# EAGLE design freeduino_hs (EAGLE 9.2.2)
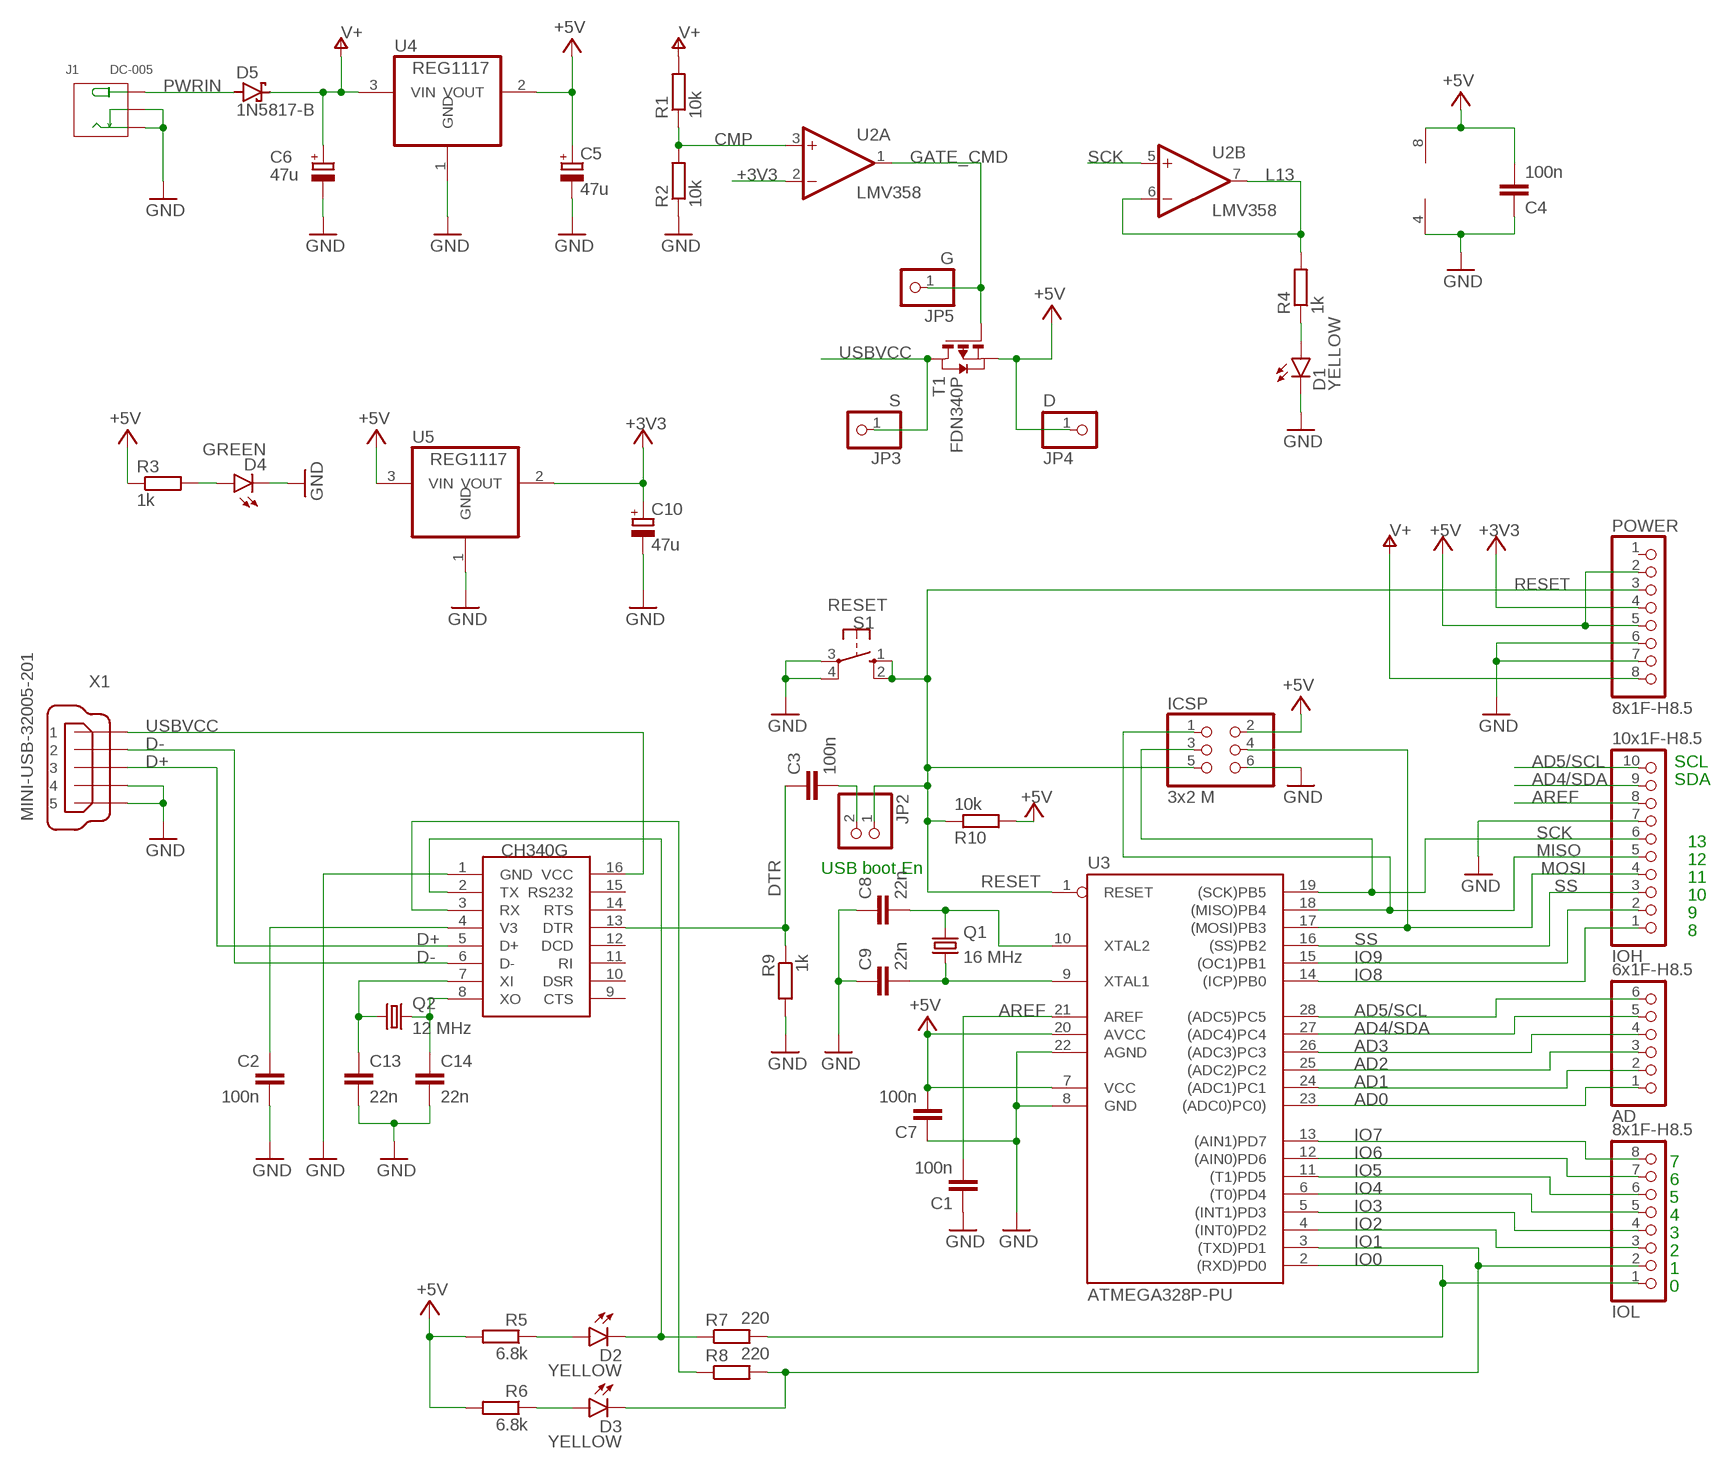
[diagram p0: schematic, sheet 1]

## Parts
AD  6x1F-H8.5  PINHD-1X6  [1X06]
C1  100n  C-EU050-024X044  [C050-024X044]
C2  100n  C-EU050-024X044  [C050-024X044]
C3  100n  C-EU050-024X044  [C050-024X044]
C4  100n  C-EU050-024X044  [C050-024X044]
C5  47u  CPOL-EUE2.5-5  [E2,5-5]
C6  47u  CPOL-EUE2.5-5  [E2,5-5]
C7  100n  C-EU050-024X044  [C050-024X044]
C8  22n  C-EU050-024X044  [C050-024X044]
C9  22n  C-EU050-024X044  [C050-024X044]
C10  47u  CPOL-EUE2.5-5  [E2,5-5]
C13  22n  C-EU050-024X044  [C050-024X044]
C14  22n  C-EU050-024X044  [C050-024X044]
D1  YELLOW  LED3MM  [LED3MM]
D2  YELLOW  LED3MM  [LED3MM]
D3  YELLOW  LED3MM  [LED3MM]
D4  GREEN  LED3MM  [LED3MM]
D5  1N5817-B  [DO41-7.6]
ICSP  3x2 M  PINHD-2X3  [2X03]
IOH  10x1F-H8.5  PINHD-1X10  [1X10]
IOL  8x1F-H8.5  PINHD-1X8  [1X08]
J1  DC-005  CONN-POWER-JACK-2.1MM(DC-005)  [DCJ3P-14.2X11.0X9.0MM]
JP2  PINHD-1X2  [1X02]
JP3  S  PINHD-1X1  [1X01]
JP4  D  PINHD-1X1  [1X01]
JP5  G  PINHD-1X1  [1X01]
POWER  8x1F-H8.5  PINHD-1X8  [1X08]
Q1  16 MHz  CRYSTALHC49S  [HC49/S]
Q2  12 MHz  CRYSTALHC49S  [HC49/S]
R1  10k  R-EU_0204/7  [0204/7]
R2  10k  R-EU_0204/7  [0204/7]
R3  1k  R-EU_0204/7  [0204/7]
R4  1k  R-EU_0204/7  [0204/7]
R5  6.8k  R-EU_0204/7  [0204/7]
R6  6.8k  R-EU_0204/7  [0204/7]
R7  220  R-EU_0204/7  [0204/7]
R8  220  R-EU_0204/7  [0204/7]
R9  1k  R-EU_0204/7  [0204/7]
R10  10k  R-EU_0204/7  [0204/7]
S1  RESET  10-XX  [B3F-10XX]
T1  FDN340P  PMOSSOT23  [SOT-23]
U1  CH340G  [SOIC16]
U2  LMV358  LMV358M  [SO08]
U3  ATMEGA328P-PU  [DIL28-3]
U4  REG1117  [SOT223]
U5  REG1117  [SOT223]
X1  MINI-USB-32005-201  [32005-201]

## Nets
+3V3: C10.+ POWER.4 U2.2(A:-IN) U5.2(VOUT)
+5V [power]: C4.2 C5.+ C7.2 ICSP.2 JP4.1 POWER.2 POWER.5 R3.1 R5.2 R6.2 R10.2 T1.2(S) U2.8(P:V+) U3.7(VCC) U3.20(AVCC) U4.2(VOUT) U5.3(VIN)
AD0: AD.1 U3.23((ADC0)PC0))
AD1: AD.2 U3.24((ADC1)PC1)
AD2: AD.3 U3.25((ADC2)PC2)
AD3: AD.4 U3.26((ADC3)PC3)
AD4/SDA: AD.5 IOH.9 U3.27((ADC4)PC4)
AD5/SCL: AD.6 IOH.10 U3.28((ADC5)PC5)
AREF [aref]: C1.2 IOH.8 U3.21(AREF)
CMP: R1.1 R2.2 U2.3(A:+IN)
D+: U1.5(D+) X1.3
D-: U1.6(D-) X1.2
DTR: C3.1 R9.1 U1.13(DTR)
GATE_CMD: JP5.1 T1.3(G) U2.1(A:OUT)
GND [gnd]: C1.1 C2.2 C4.1 C5.- C6.- C7.1 C8.1 C9.1 C10.- C13.2 C14.2 D1.K(C) D4.K(C) ICSP.6 IOH.7 J1.-1(-) J1.-2(CDN) POWER.6 POWER.7 R2.1 R9.2 S1.3(P) S1.4(P1) U1.1(GND) U2.4(P:V-) U3.8(GND) U3.22(AGND) U4.1(GND) U5.1(GND) X1.4 X1.5
IO0: IOL.1 R7.2 U3.2((RXD)PD0)
IO1: D3.K(C) IOL.2 R8.2 U3.3((TXD)PD1)
IO2: IOL.3 U3.4((INT0)PD2)
IO3: IOL.4 U3.5((INT1)PD3)
IO4: IOL.5 U3.6((T0)PD4)
IO5: IOL.6 U3.11((T1)PD5)
IO6: IOL.7 U3.12((AIN0)PD6)
IO7: IOL.8 U3.13((AIN1)PD7)
IO8: IOH.1 U3.14((ICP)PB0)
IO9: IOH.2 U3.15((OC1)PB1)
L13: R4.2 U2.6(B:-IN) U2.7(B:OUT)
M8RXD: R8.1 U1.3(RX)
MISO: ICSP.1 IOH.5 U3.18((MISO)PB4)
MOSI: ICSP.4 IOH.4 U3.17((MOSI)PB3)
N$1: D1.A R4.1
N$2: C2.1 U1.4(V3)
N$3: D4.A R3.2
N$4: C3.2 JP2.2
N$35: D3.A R6.1
N$36: D2.A R5.1
N$93: D2.K(C) R7.1 U1.2(TX)
PWRIN [power]: D5.A J1.+
RESET: ICSP.5 JP2.1 POWER.3 R10.1 S1.1(S) S1.2(S1) U3.1(RESET)
SCK: ICSP.3 IOH.6 U2.5(B:+IN) U3.19((SCK)PB5)
SS: IOH.3 U3.16((SS)PB2)
USBVCC [usbvcc]: JP3.1 T1.1(D) U1.16(VCC) X1.1
V+: C6.+ D5.C POWER.8 R1.2 U4.3(VIN)
XI: C13.1 Q2.2 U1.7(XI)
XO: C14.1 Q2.1 U1.8(XO)
XTAL1: C9.2 Q1.1 U3.9(XTAL1)
XTAL2: C8.2 Q1.2 U3.10(XTAL2)
Unconnected: POWER.1 U1.9(CTS) U1.10(DSR) U1.11(RI) U1.12(DCD) U1.14(RTS) U1.15(RS232)

## Notes on the sheet
- SCL
- SDA
- 13
- 12
- USB boot En
- 11
- 10
- 9
- 8
- 7
- 6
- 5
- 4
- 3
- 2
- 1
- 0

## Library data of the parts
AD = SmartPrj:PINHD-1X6: PIN HEADER
C1-C4 C7-C9 C13 C14 = rcl_edited:C-EU: CAPACITOR, European symbol; SPICEPREFIX: C
C5 C6 C10 = rcl:CPOL-EU: POLARIZED CAPACITOR, European symbol; SPICEPREFIX: C
D1-D4 = led:LED: LED OSRAM: - CHIPLED LG R971, LG N971, LY N971, LG Q971, LY Q971, LO R971, LY R971 LH N974, LH R974 LS Q976, LO Q976, LY Q976 LO Q996 - Hyper CHIPLED LW Q18S LB Q993, LB Q99A, LB R99A - SideLED LS A670, LO A670, LY A670, LG A670, LP A670 LB A673, LV A673, LT A673, LW A673 LH A674 LY A675 LS A676, LA A676, LO A676, LY A676, LW A676 LS A679, LY A679, LG A679 - Hyper Micro SIDELED® LS Y876, LA Y876, LO Y876, LY Y876 LT Y87S - SmartLED LW L88C, LW L88S LB L89C, LB L89S, LG L890 LS L89K, LO L89K, LY L89K LS L896, LA L896, LO L896, LY L896 - TOPLED LS T670, LO T670, LY T670, LG T670, LP T670 LSG T670, LSP T670, LSY T670, LOP T670, LYG T670 LG T671, LOG T671, LSG T671 LB T673, LV T673, LT T673, LW T673 LH T674 LS T676, LA T676, LO T676, LY T676, LB T676, LH T676, LSB T676, LW T676 LB T67C, LV T67C, LT T67C, LS T67K, LO T67K, LY T67K, LW E67C LS E67B, LA E67B, LO E67B, LY E67B, LB E67C, LV E67C, LT E67C LW T67C LS T679, LY T679, LG T679 LS T770, LO T770, LY T770, LG T770, LP T770 LB T773, LV T773, LT T773, LW T773 LH T774 LS E675, LA E675, LY E675, LS T675 LS T776, LA T776, LO T776, LY T776, LB T776 LHGB T686 LT T68C, LB T68C - Hyper Mini TOPLED® LB M676 - Mini TOPLED Santana® LG M470 LS M47K, LO M47K, LY M47K Source: http://www.osram.convergy.de LUXEON: - LUMILED® LXK2-PW12-R00, LXK2-PW12-S00, LXK2-PW14-U00, LXK2-PW14-V00 LXK2-PM12-R00, LXK2-PM12-S00, LXK2-PM14-U00 LXK2-PE12-Q00, LXK2-PE12-R00, LXK2-PE12-S00, LXK2-PE14-T00, LXK2-PE14-U00 LXK2-PB12-K00, LXK2-PB12-L00, LXK2-PB12-M00, LXK2-PB14-N00, LXK2-PB14-P00, LXK2-PB14-Q00 LXK2-PR12-L00, LXK2-PR12-M00, LXK2-PR14-Q00, LXK2-PR14-R00 LXK2-PD12-Q00, LXK2-PD12-R00, LXK2-PD12-S00 LXK2-PH12-R00, LXK2-PH12-S00 LXK2-PL12-P00, LXK2-PL12-Q00, LXK2-PL12-R00 Source: www.luxeon.com KINGBRIGHT: KA-3528ASYC Source: www.kingbright.com
D5 = diode:1N581*: 1.0A SCHOTTKY BARRIER RECTIFIER Source: http://www.diodes.com/datasheets/ds23001.pdf
ICSP = SmartPrj:PINHD-2X3: PIN HEADER
IOH = pinhead:PINHD-1X10: PIN HEADER
IOL POWER = SmartPrj:PINHD-1X8: PIN HEADER
J1 = OPL_Connector:CONN-POWER-JACK-2.1MM(DC-005): 320120003; MPN: DC-005
JP2 = pinhead:PINHD-1X2: PIN HEADER
JP3-JP5 = pinhead:PINHD-1X1: PIN HEADER
Q1 Q2 = crystal:CRYSTAL: CRYSTAL; OC_FARNELL: 1667008; OC_NEWARK: unknown
R1-R10 = resistor:R-EU_: RESISTOR, European symbol
S1 = switch-omron:10-XX: OMRON SWITCH; MPN: B3F-1000; OC_FARNELL: 176432; OC_NEWARK: 36M3542
T1 = zetex:PMOSSOT23: MOS FET; OC_FARNELL: unknown; OC_NEWARK: unknown
U1 = ch340g:CH340G
U2 = linear:LMV358?*: Dual General Purpose, Low Voltage, Rail-to-Rail Output Operational Amplifiers Source: http://www.national.com/mpf/LM/LMV321.html http://www.national.com/dt/lmv_qual.pdf
U3 = SmartPrj:ATMEGA328P-: MICROCONTROLLER 4 Kbytes FLASH 128 bytes SRAM 256 bytes EEPROM UART 6-channel 10 bit ADC
U4 U5 = burr-brown:REG1117: 800mA and 1A Low Dropout (LDO) Positive Regulator 1.8V, 2.5V, 2.85V, 3.3V, 5V, and Adj; MPN: REG1117; OC_FARNELL: 1097566; OC_NEWARK: 14P6981
X1 = con-cypressindustries:MINI-USB-: MINI USB-B Conector Source: www.cypressindustries.com; OC_FARNELL: unknown; OC_NEWARK: unknown

## Net classes
0 default: width 0.406 mm, drill 0.305 mm, clearance 0.152 mm
1 power: width 0.508 mm, drill 0.305 mm, clearance 0.152 mm
2 gnd: width 1.016 mm, drill 0.305 mm, clearance 0.152 mm
3 usbvcc: width 1.016 mm, drill 0.305 mm, clearance 0.152 mm
4 aref: width 0.406 mm, drill 0.305 mm, clearance 0.152 mm

## Board
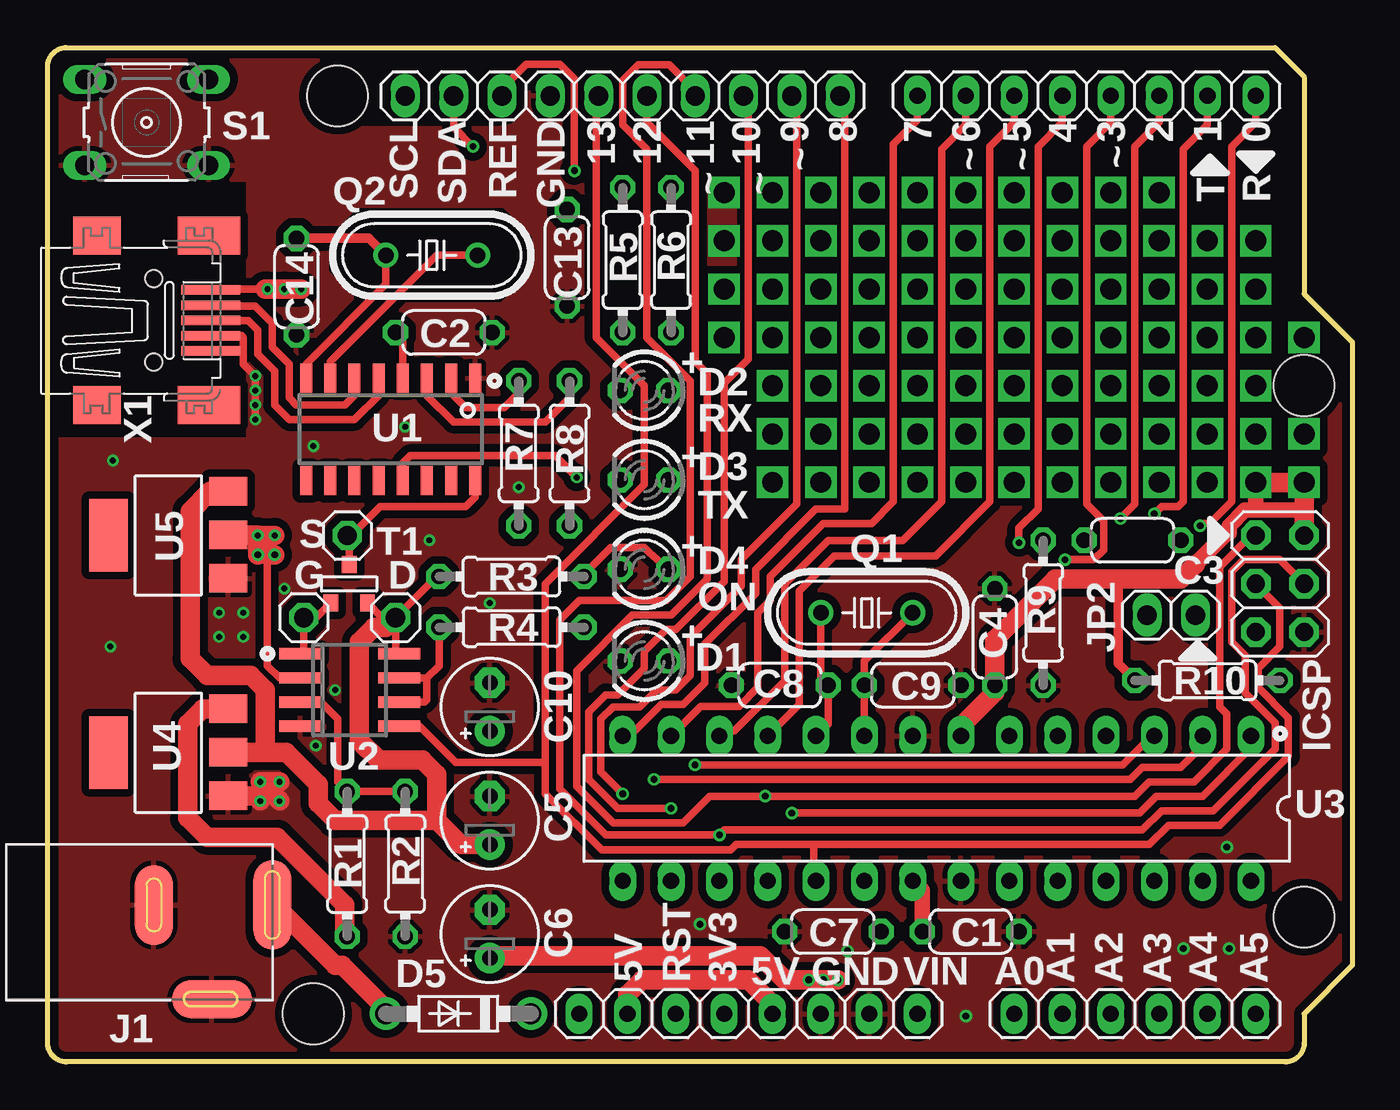
[diagram p1: board, top side]
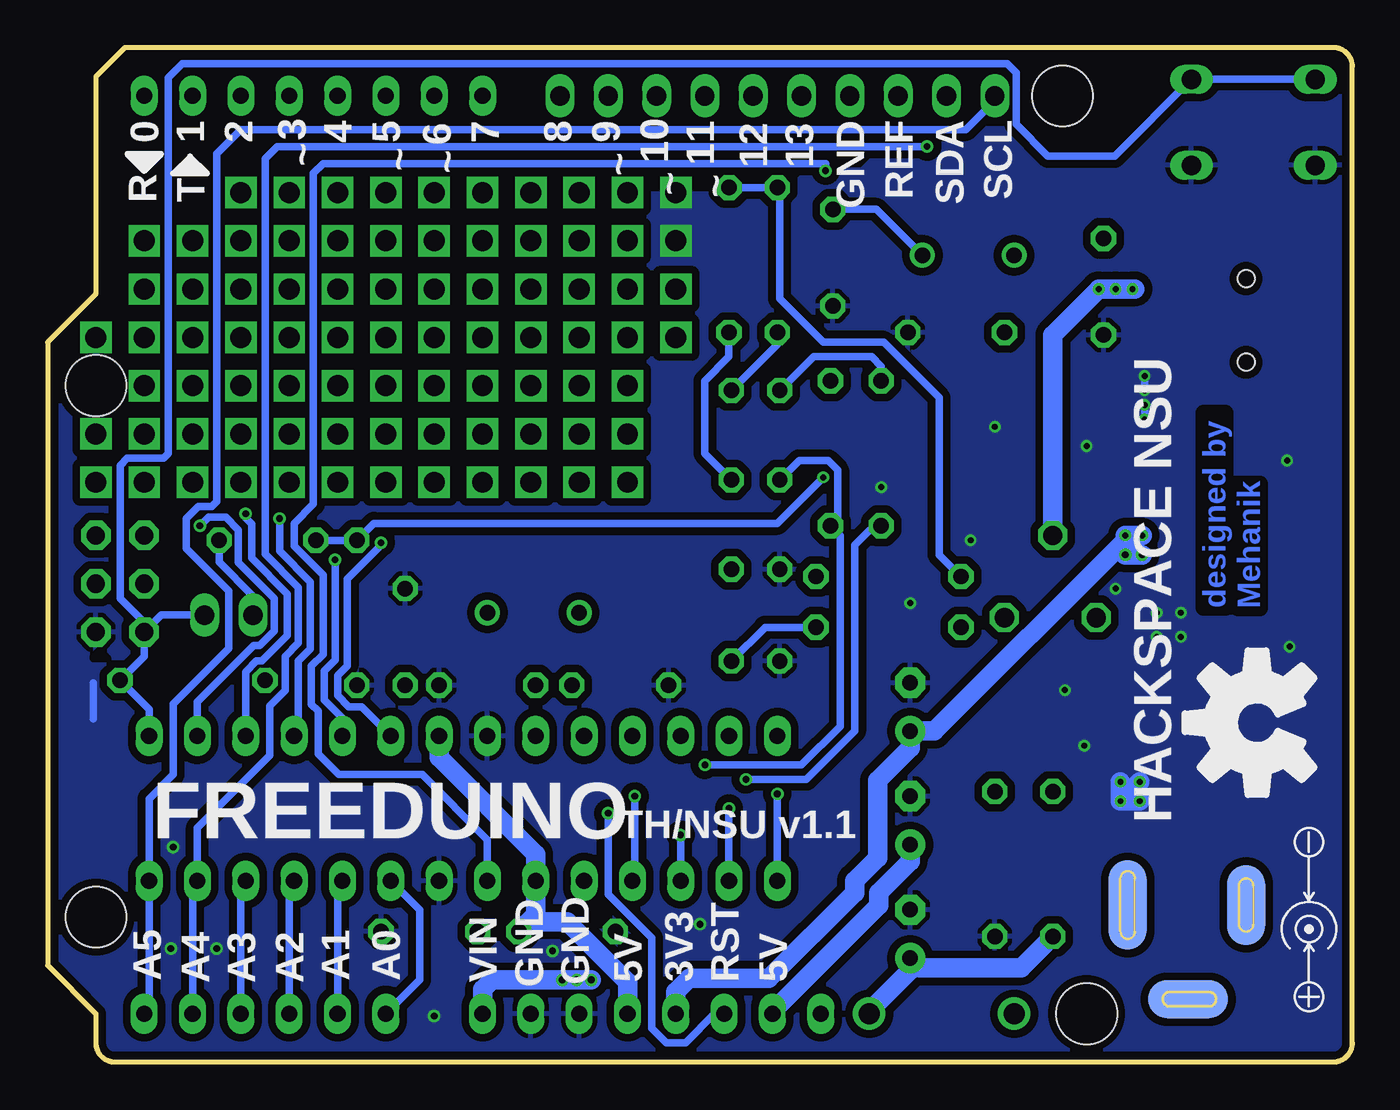
[diagram p2: board, bottom side, seen from below]

Size 68.58 x 53.34 mm. Coordinates in mm from the lower left corner, seen from the top.
Outline: 64.52,53.34 66.04,51.82 66.04,40.39 68.58,37.85 68.58,5.08 66.04,2.54 66.04,1 arc-90 65.04,0 1,0 arc-90 0,1 0,52.34 arc-90 1,53.34 64.52,53.34
Copper layers (1*16): Top 0.035mm / dielectric 1.5mm / Bottom 0.035mm
Design rules "SeeedStudio_2layer_DRU_no_angle_20140221 *": minimum track width 6mil, minimum drill 0.3mm, track to track 6mil, track to pad 6mil, pad to pad 6mil, via to via 6mil, smd to smd 0mil, copper to edge 10mil, drill to drill 10mil, minimum pad ring 10mil, minimum via ring 6mil, stop-mask expansion 2mil, vias tented up to drill 100mil, thermal gap 10mil
Holes 3.2 mm at 66.04,35.56 66.04,7.62 15.24,50.8 13.97,2.54
vRestrict: area 22.9,44.1 to 24.6,49.1; area 25.4,45.5 to 27.1,49.1; area 28.4,45.3 to 29.6,48.8; area 31,45.3 to 32.1,48.8; area 33.5,45.3 to 34.7,48.8; area 36.1,45.3 to 37.2,48.8; area 38.7,47.2 to 39.9,48.8; area 40.3,45.1 to 47.6,46.9; area 60.3,44.2 to 61.7,46.7; area 62.9,44.2 to 64.3,46.7; area 61.3,35.8 to 64.8,37.2; area 0.6,21.8 to 2,30.1; 14 more areas

### Footprints (pad centres in the part's own frame; a part is rotated, then mirrored left to right if it is on the bottom)
1X06 = drill 0.85 pad 1.422 long: 1 -6.35,0; 2 -3.81,0; 3 -1.27,0; 4 1.27,0; 5 3.81,0; 6 6.35,0
C050-024X044 = drill 0.813 octagon: 1 -2.54,0; 2 2.54,0
E2,5-5 = drill 0.813 pad 1.6: + -1.27,0 | drill 0.813 pad 1.6 octagon: - 1.27,0
LED3MM = drill 0.813 octagon: A -1.27,0; K 1.27,0
DO41-7.6 = drill 1.1 pad 1.7: A 3.81,0; C -3.81,0
2X03 = drill 0.95 pad 1.55 octagon: 1 -2.54,-1.27; 2 -2.54,1.27; 3 0,-1.27; 4 0,1.27; 5 2.54,-1.27; 6 2.54,1.27
1X10 = drill 1.016 long: 1 -11.43,0; 2 -8.89,0; 3 -6.35,0; 4 -3.81,0; 5 -1.27,0; 6 1.27,0; 7 3.81,0; 8 6.35,0; 9 8.89,0; 10 11.43,0
1X08 = drill 0.85 pad 1.422 long: 1 -8.89,0; 2 -6.35,0; 3 -3.81,0; 4 -1.27,0; 5 1.27,0; 6 3.81,0; 7 6.35,0; 8 8.89,0
DCJ3P-14.2X11.0X9.0MM = smd 2 x 4.7: + 3.175,0 | smd 2 x 4.7 bottom: +1 3.175,0 | smd 2 x 4.2: -1 -3.048,0 | smd 4.2 x 2: -2 0,-4.953 | smd 2 x 4.2 bottom: -3 -3.048,0 | smd 4.2 x 2 bottom: -4 0,-4.953
1X02 = drill 1.016 long: 1 -1.27,0; 2 1.27,0
1X01 = drill 1.016 octagon: 1 0,0
HC49/S = drill 0.813: 1 -2.413,0; 2 2.413,0
0204/7 = drill 0.813 octagon: 1 -3.81,0; 2 3.81,0
B3F-10XX = drill 1.016 long: 1 -3.251,2.261; 2 3.251,2.261; 3 -3.251,-2.261; 4 3.251,-2.261
SOT-23 = smd 0.787 x 0.889: 1 0.025,-1.016; 2 -0.94,1.016; 3 0.991,1.016
SOIC16 = smd 0.635 x 1.524: 1 -4.445,-2.695; 2 -3.175,-2.695; 3 -1.905,-2.695; 4 -0.635,-2.695; 5 0.635,-2.695; 6 1.905,-2.695; 7 3.175,-2.695; 8 4.445,-2.695; 9 4.445,2.695; 10 3.175,2.695; 11 1.905,2.695; 12 0.635,2.695; 13 -0.635,2.695; 14 -1.905,2.695; 15 -3.175,2.695; 16 -4.445,2.695
SO08 = smd 0.6 x 2.2: 1 -1.905,-2.6; 2 -0.635,-2.6; 3 0.635,-2.6; 4 1.905,-2.6; 5 1.905,2.6; 6 0.635,2.6; 7 -0.635,2.6; 8 -1.905,2.6
DIL28-3 = drill 0.85 pad 1.422 long: 1 -16.51,-3.81; 2 -13.97,-3.81; 3 -11.43,-3.81; 4 -8.89,-3.81; 5 -6.35,-3.81; 6 -3.81,-3.81; 7 -1.27,-3.81; 8 1.27,-3.81; 9 3.81,-3.81; 10 6.35,-3.81; 11 8.89,-3.81; 12 11.43,-3.81; 13 13.97,-3.81; 14 16.51,-3.81; 15 16.51,3.81; 16 13.97,3.81; 17 11.43,3.81; 18 8.89,3.81; 19 6.35,3.81; 20 3.81,3.81; 21 1.27,3.81; 22 -1.27,3.81; 23 -3.81,3.81; 24 -6.35,3.81; 25 -8.89,3.81; 26 -11.43,3.81; 27 -13.97,3.81; 28 -16.51,3.81
SOT223 = smd 1.499 x 2.007: 1 -2.261,-3.15; 2 0.025,-3.15; 3 2.311,-3.15 | smd 3.81 x 2.007: 4 0,3.15
32005-201 = smd 3.1 x 0.5: 1 3,1.6; 2 3,0.8; 3 3,0; 4 3,-0.8; 5 3,-1.6 | smd 2.5 x 2: M1 -3,-4.45; M2 -3,4.45 | smd 3.3 x 2: M3 2.9,4.45; M4 2.9,-4.45 | hole 0.9: 0,2.2; 0,-2.2

### Placement (x,y rotation side)
AD  57.15,2.54 0 top
C1  48.51,6.86 180 top
C2  20.83,38.35 0 top
C3  57.02,27.43 0 top
C4  49.78,22.35 270 top
C5  23.24,12.7 90 top
C6  23.24,6.73 90 top
C7  41.27,6.86 0 top
C8  38.48,19.81 0 top
C9  45.47,19.81 180 top
C10  23.24,18.67 90 top
C13  27.3,42.29 270 top
C14  13.08,40.77 270 top
D1  31.37,21.08 180 top
D2  31.37,35.31 180 top
D3  31.37,30.61 180 top
D4  31.37,25.91 180 top
D5  21.59,2.54 180 top
ICSP  64.77,25.15 270 top
IOH  30.23,50.8 180 top
IOL  54.61,50.8 180 top
J1  8.64,8.26 0 top
JP2  59.05,23.5 180 top
JP3  15.75,27.69 0 top
JP4  18.29,23.37 0 top
JP5  13.46,23.37 0 top
POWER  36.83,2.54 0 top
Q1  43.05,23.62 180 top
Q2  20.19,42.42 0 top
R1  15.75,10.41 270 top
R2  18.8,10.41 90 top
R3  24.38,25.53 0 top
R4  24.38,22.86 180 top
R5  30.23,42.16 90 top
R6  32.77,42.16 90 top
R7  24.77,32 270 top
R8  27.43,32 270 top
R9  52.32,23.62 270 top
R10  60.96,20.07 180 top
S1  5.21,49.4 0 top
T1  15.88,25.15 180 top
U1  18.03,33.27 180 top
U2  15.88,19.56 270 top
U3  46.74,13.34 180 top
U4  6.35,16.26 90 top
U5  6.35,27.69 90 top
X1  5.59,38.99 0 top

### Tracks (layer width: path | path; a pad name or v marks a point on that pad's centre or on a via)
+3V3  (via drill 0.3, 0.35)
  Top 0.406: U2.2 12.19,20.19 11.56,20.83 11.56,26.67 11.56,27.3 v11.94,27.69
  Top 1.016: U5.2 11.02,27.71 v11.05,27.69 | v11.05,27.69 v11.94,27.69 | v11.05,27.69 v11.05,26.67 | v11.94,26.67 11.56,26.67
  Bottom 1.016: v11.05,27.69 v11.94,27.69 11.94,27.43 21.97,17.4 C10.+ 23.24,16.51 24.96,14.8 24.96,10.73 26.16,9.53 26.16,8.91 30.67,4.39 34.85,4.39 35.56,3.68 POWER.4 | v11.05,26.67 v11.94,26.67
+5V  (via drill 1.1 pad 1.27)
  Top 0.406: T1.2 17.58,23.37 JP4.1 | JP4.1 18.29,21.65 U2.8 | R3.1 20.45,25.53 JP4.1
  Top 0.508: R10.2 56.26,20.95 56.26,25.4
  Top 0.813: 66.04,28.83 65.85,29.02 63.63,29.02 | 63.63,29.02 62.93,29.02 62.1,28.19 62.1,27.81 61.98,27.81 60.33,26.16 | 63.63,29.02 63.5,29.15 v63.5,30.48
  Top 1.016: U4.2 11.43,16.28 | 11.43,16.28 12.55,16.28 14.22,14.61 14.22,13.59 15.11,12.7 20.45,12.7 | 20.45,12.7 20.45,15.11 19.68,15.88 17.4,15.88 16.38,16.89 16.38,22.1 17.14,22.86 17.78,22.86 JP4.1 | 11.43,16.28 11.43,19.56 10.67,20.32 8.38,20.32 7.49,21.21 7.49,28.96 8.53,30 U5.3 | 42.8,9.4 U3.20 | C5.+ 21.72,11.43 20.45,12.7 | U3.7 48.01,17.65 49.78,19.43 C4.2 49.78,22.23 52.96,25.4 56.26,25.4 59.56,25.4 60.33,26.16 | POWER.2 30.48,3.56 31.24,4.32 36.83,4.32 38.1,3.05 POWER.5 | v63.5,30.48 v66.04,30.48 66.04,28.83 ICSP.2
  Bottom 0.406: R6.2 R5.2 30.1,45.85 30.1,40.13 27.81,37.85 24.64,37.85 21.72,34.92 21.72,26.67 R3.1
  Bottom 1.016: U3.7 48.01,16 42.93,10.92 U3.20 | POWER.2 30.48,2.65 24.89,8.24 24.89,8.89 23.24,10.54 C5.+ | 42.93,8.64 U3.20 | C7.2 42.93,7.75 | 42.93,7.75 42.93,7.37 41.27,7.37 38.1,4.19 POWER.5 | 42.93,7.75 U3.20
AD0
  Top 0.406: U3.23 50.67,9.53
  Bottom 0.406: AD.1 49.02,4.32 49.02,8 U3.23
AD1
  Bottom 0.406: AD.2 53.34,9.27 U3.24
AD2
  Top 0.406: AD.3 55.63,2.79
  Bottom 0.406: AD.3 55.88,9.27 U3.25
AD3
  Top 0.406: AD.4 58.17,2.79
  Bottom 0.406: AD.4 58.42,9.27 U3.26
AD4/SDA  (via drill 0.35)
  Top 0.406: IOH.9 21.34,49.15 v22.35,48.13
  Bottom 0.406: v22.35,48.13 56.52,48.13 57.15,47.5 57.15,26.7 55.4,24.95 55.4,22.02 56.08,21.34 56.08,19.54 56.9,18.73 56.9,16.13 60.71,12.32 U3.27 60.96,9.27 AD.5
AD5/SCL
  Top 0.406: 63.63,9.91 U3.28
  Bottom 0.406: IOH.10 18.8,50.55 20.32,49.02 58.42,49.02 59.69,47.75 59.69,29.46 59.94,29.21 60.66,29.21 61.29,28.57 61.29,27 59.05,24.77 59.05,21.75 61.98,18.82 61.98,15.11 63.25,13.84 U3.28 63.25,2.79 AD.6
AREF  (via drill 0.35)
  Top 0.406: IOH.8 24,50.93 24,51.31 25.15,52.45 26.92,52.45 27.69,51.69 v27.69,46.86
  Top 0.813: C1.2 45.97,9.02 U3.21
  Bottom 0.406: v27.69,46.86 27.69,47.24 54.1,47.24 54.61,46.74 54.61,29.34 55.63,28.32 55.63,27.14 54.1,25.61 54.1,21.42 54.71,20.81 54.71,18.8 54.36,18.45 54.36,16.2 53.27,15.11 48.9,15.11 45.47,11.68 U3.21
CMP
  Top 0.406: R2.2 R1.1 15.24,14.73 15.24,18.03 14.35,18.92 U2.3
D+
  Top 0.406: X1.3 10.54,38.99 11.05,38.48 11.05,37.21 11.94,36.32 11.94,34.54 12.7,33.78 16.13,33.78 17.4,35.05 U1.5
D-
  Top 0.406: U1.6 16.13,35.05 15.62,34.54 13.08,34.54 12.7,34.92 12.7,36.7 11.81,37.59 11.81,38.86 10.92,39.75 8.63,39.75 X1.2
DTR  (via drill 0.3)
  Top 0.406: U1.13 18.67,31.5 19.05,31.88 26.67,31.88 v27.81,30.73
  Bottom 0.406: v27.81,30.73 30.23,28.32 51.44,28.32 R9.1 C3.1
GATE_CMD
  Top 0.406: T1.3 14.12,23.37 JP5.1 13.46,21.65 U2.1
GND  (via drill 0.3, 0.35, 1.1 pad 1.27)
  Top 0.406: v10.92,34.54 v10.92,35.31 v10.92,36.07 10.29,36.7 10.29,37.34 | v10.92,33.78 10.92,34.42 | X1.4 10.2,38.19 10.29,38.1 10.29,37.34 | X1.5 10.24,37.39 10.29,37.34
  Top 1.016: U4.1 11.15,13.99 v11.18,13.72 | v12.19,13.72 v11.18,14.73 v12.19,14.73
  Bottom 0.406: v10.92,36.07 v10.92,35.31 | v10.92,34.54 v10.92,33.78 | 66.17,18.03 66.17,19.94
  Bottom 1.016: v11.18,13.72 v12.19,13.72 | v11.18,14.73 v12.19,13.72 | v12.19,13.72 v12.19,14.73
  other vias: 14.1,16.64 9.02,23.62 10.29,23.62 9.02,22.35 10.29,22.35 3.3,21.84 3.43,31.62 20.07,27.43 24.77,30.23 18.8,33.4 13.97,32.38 12.45,24.89 23.24,24.13 15.11,19.56 35.56,45.72 35.56,43.18 42.04,5.84 48.26,2.41 59.69,5.97 62.1,5.97 61.98,11.3 34.29,7.24
  pour Bottom (isolate 0.406): 0.64,52.7 67.69,52.7 67.94,52.45 67.94,0.64 0.89,0.64 0.64,0.89
  pour Top (isolate 0.406): 0.64,52.7 67.94,52.7 67.94,0.64 0.64,0.64 0.64,32.77 10.54,32.77 10.54,46.35 0.64,46.35
IO0  (via drill 0.35)
  Top 0.406: IOL.1 63.5,49.4 62.23,48.13 62.23,29.46 61.09,28.32 60.58,28.32 v60.58,28.19 | 60.45,17.14 U3.2 60.71,16.64 59.56,15.49 57.53,15.49 56.9,14.86 v31.88,14.86
  Bottom 0.406: v31.88,14.86 28.7,14.86 26.16,17.4 26.16,27.18 25.4,27.94 25.02,27.94 R7.2 | U3.2 60.71,18.92 57.73,21.89 57.42,21.89 56.67,22.65 56.67,24.38 58.55,26.26 58.55,27.98 59.22,28.65 60.12,28.65 v60.58,28.19
IO1  (via drill 0.35)
  Top 0.406: 58.17,17.91 U3.3 58.04,17.14 56.52,15.62 v34.04,15.62 | IOL.2 60.96,49.28 59.69,48.01 59.69,29.46 59.44,29.21 58.55,29.21 v58.17,28.83
  Bottom 0.406: D3.K 29.08,31.62 27.56,31.62 27.05,31.11 27.05,28.57 R8.2 26.92,27.69 26.92,17.65 28.96,15.62 v34.04,15.62 | U3.3 58.17,20.52 57.6,21.08 57.32,21.08 55.98,22.42 55.98,24.61 57.86,26.5 57.86,28.3 58.17,28.6 v58.17,28.83
IO2  (via drill 0.35)
  Top 0.406: IOL.3 58.42,49.4 57.15,48.13 57.15,29.34 v56.39,28.57 | U3.4 55.63,17.65
  Bottom 0.406: U3.4 55.63,17.65 55.4,17.88 55.4,21.08 54.77,21.7 54.77,25.24 56.39,26.86 v56.39,28.57
IO3  (via drill 0.35)
  Top 0.406: IOL.4 55.88,49.4 54.61,48.13 54.61,29.34 55.5,28.45 55.5,26.92 54.99,26.42 v53.47,26.42
  Bottom 0.406: U3.5 53.09,18.09 54.03,19.03 54.03,20.57 53.47,21.13 v53.47,26.42
IO4  (via drill 0.35)
  Top 0.406: IOL.5 53.34,49.4 52.07,48.13 52.07,29.08 51.05,28.07 v51.05,27.3
  Bottom 0.406: U3.6 52.07,18.67 52.74,18.67 53.34,19.26 53.34,20.32 52.83,20.83 52.83,25.4 51.05,27.18 v51.05,27.3
IO5
  Top 0.406: IOL.6 50.8,49.4 49.53,48.13 49.53,29.46 46.67,26.61 41.34,26.61 39.5,24.77 39.5,18.8 U3.11
IO6
  Top 0.406: IOL.7 48.26,49.28 46.99,48.01 46.99,29.46 44.96,27.43 41.02,27.43 38.73,25.15 38.73,20.04 36.1,17.4 35.31,17.4 | U3.12 35.31,17.4 | 35.31,17.4 35.31,17.53
IO7
  Top 0.406: IOL.8 45.72,49.53 44.45,48.26 44.45,29.46 43.31,28.32 40.77,28.32 37.97,25.53 37.97,24.26 37.34,23.62 37.34,19.68 36.35,18.7 34.32,18.7 U3.13 33.02,17.14 33.02,17.27
IO8
  Top 0.406: U3.14 30.61,17.14 32.26,18.8 33.4,18.8 34.54,19.94 34.54,21.97 37.21,24.64 37.21,25.91 40.39,29.08 41.91,29.08 41.91,50.55 IOH.1
IO9  (via drill 0.35)
  Top 0.406: IOH.2 39.37,50.55 39.37,29.34 36.45,26.42 36.45,25.02 33.78,22.35 33.78,20.32 33.02,19.56 32,19.56 31.11,18.67 29.72,18.67 29.08,18.03 29.08,15.24 v30.23,14.1 | U3.15 30.1,9.53
  Bottom 0.406: v30.23,14.1 U3.15
L13
  Top 0.406: U2.6 19.81,18.92 19.94,19.05 19.94,20.19 | 19.94,20.19 U2.7 | R4.2 20.57,20.83 19.94,20.19
M8RXD
  Top 0.406: U1.3 19.94,35.05 21.34,33.66 26.16,33.66 27.43,34.92 R8.1
MISO  (via drill 0.35)
  Top 0.406: ICSP.1 63.25,27.69 61.59,26.04 61.59,18.67 61.98,18.29 61.98,16.45 60.26,14.73 57.91,14.73 57.15,13.97 v37.72,13.97 34.8,13.97 33.4,12.57 29.72,12.57 27.81,14.48 27.81,20.57 30.73,23.5 32.77,23.5 34.67,25.4 34.67,36.2 34.04,36.83 34.04,46.86 31.5,49.4 IOH.5
  Bottom 0.406: v37.72,13.97 37.72,9.65 U3.18
MOSI  (via drill 0.35)
  Top 0.406: ICSP.4 64.77,26.42 62.87,26.42 62.23,25.78 62.23,22.1 62.96,21.37 62.96,19.4 64.52,17.84 64.52,16.45 61.27,13.21 58.55,13.21 57.53,12.19 35.56,12.19 v35.31,11.94 29.34,11.94 26.92,14.35 26.92,23.24 27.94,24.26 32.51,24.26 33.78,25.53 33.78,35.81 31.5,38.1 31.5,48.01 30.23,49.28 30.23,51.62 31.03,52.43 32.66,52.43 34.04,51.05 IOH.4
  Bottom 0.406: U3.17 v35.31,11.94
N$1
  Bottom 0.406: R4.1 30.86,22.86 D1.A
N$2
  Top 0.406: U1.4 18.67,37.97 C2.1
N$3
  Top 0.406: D4.A 31.62,26.8 31.37,27.05 29.59,27.05 28.19,25.65 R3.2
N$4
  Bottom 0.406: JP2.2 57.78,24.51 59.56,26.29 C3.2
N$5  (via drill 1.1 pad 1.27)
  other vias: 66.04,38.1
N$6  (via drill 1.1 pad 1.27)
  other vias: 38.1,43.18
N$7  (via drill 1.1 pad 1.27)
  other vias: 40.64,43.18
N$8  (via drill 1.1 pad 1.27)
  other vias: 43.18,43.18
N$9  (via drill 1.1 pad 1.27)
  other vias: 45.72,43.18
N$10  (via drill 1.1 pad 1.27)
  other vias: 48.26,43.18
N$11  (via drill 1.1 pad 1.27)
  other vias: 50.8,43.18
N$12  (via drill 1.1 pad 1.27)
  other vias: 53.34,43.18
N$13  (via drill 1.1 pad 1.27)
  other vias: 55.88,43.18
N$14  (via drill 1.1 pad 1.27)
  other vias: 58.42,43.18
N$15  (via drill 1.1 pad 1.27)
  other vias: 40.64,45.72
N$16  (via drill 1.1 pad 1.27)
  other vias: 43.18,45.72
N$17  (via drill 1.1 pad 1.27)
  other vias: 45.72,45.72
N$18  (via drill 1.1 pad 1.27)
  other vias: 48.26,45.72
N$19  (via drill 1.1 pad 1.27)
  other vias: 50.8,45.72
N$20  (via drill 1.1 pad 1.27)
  other vias: 53.34,45.72
N$21  (via drill 1.1 pad 1.27)
  other vias: 55.88,45.72
N$22  (via drill 1.1 pad 1.27)
  other vias: 58.42,45.72
N$23  (via drill 1.1 pad 1.27)
  other vias: 35.56,40.64
N$24  (via drill 1.1 pad 1.27)
  other vias: 38.1,40.64
N$25  (via drill 1.1 pad 1.27)
  other vias: 40.64,40.64
N$26  (via drill 1.1 pad 1.27)
  other vias: 43.18,40.64
N$27  (via drill 1.1 pad 1.27)
  other vias: 45.72,40.64
N$28  (via drill 1.1 pad 1.27)
  other vias: 48.26,40.64
N$29  (via drill 1.1 pad 1.27)
  other vias: 50.8,40.64
N$30  (via drill 1.1 pad 1.27)
  other vias: 53.34,40.64
N$31  (via drill 1.1 pad 1.27)
  other vias: 55.88,40.64
N$32  (via drill 1.1 pad 1.27)
  other vias: 58.42,40.64
N$33  (via drill 1.1 pad 1.27)
  other vias: 60.96,40.64
N$34  (via drill 1.1 pad 1.27)
  other vias: 63.5,40.64
N$35
  Bottom 0.406: 32.77,38.1 R6.1 32.77,37.08 34.04,35.81 34.04,32 D3.A
N$36
  Bottom 0.406: R5.1 30.23,37.72 D2.A
N$37  (via drill 1.1 pad 1.27)
  other vias: 35.56,38.1
N$38  (via drill 1.1 pad 1.27)
  other vias: 38.1,38.1
N$39  (via drill 1.1 pad 1.27)
  other vias: 40.64,38.1
N$40  (via drill 1.1 pad 1.27)
  other vias: 43.18,38.1
N$41  (via drill 1.1 pad 1.27)
  other vias: 45.72,38.1
N$42  (via drill 1.1 pad 1.27)
  other vias: 48.26,38.1
N$43  (via drill 1.1 pad 1.27)
  other vias: 50.8,38.1
N$44  (via drill 1.1 pad 1.27)
  other vias: 53.34,38.1
N$45  (via drill 1.1 pad 1.27)
  other vias: 55.88,38.1
N$46  (via drill 1.1 pad 1.27)
  other vias: 58.42,38.1
N$47  (via drill 1.1 pad 1.27)
  other vias: 60.96,38.1
N$48  (via drill 1.1 pad 1.27)
  other vias: 63.5,38.1
N$49  (via drill 1.1 pad 1.27)
  other vias: 38.1,35.56
N$50  (via drill 1.1 pad 1.27)
  other vias: 40.64,35.56
N$51  (via drill 1.1 pad 1.27)
  other vias: 43.18,35.56
N$52  (via drill 1.1 pad 1.27)
  other vias: 45.72,35.56
N$53  (via drill 1.1 pad 1.27)
  other vias: 48.26,35.56
N$54  (via drill 1.1 pad 1.27)
  other vias: 50.8,35.56
N$55  (via drill 1.1 pad 1.27)
  other vias: 53.34,35.56
N$56  (via drill 1.1 pad 1.27)
  other vias: 55.88,35.56
N$57  (via drill 1.1 pad 1.27)
  other vias: 58.42,35.56
N$58  (via drill 1.1 pad 1.27)
  other vias: 60.96,35.56
N$59  (via drill 1.1 pad 1.27)
  other vias: 63.5,35.56
N$60  (via drill 1.1 pad 1.27)
  other vias: 38.1,33.02
N$61  (via drill 1.1 pad 1.27)
  other vias: 40.64,33.02
N$62  (via drill 1.1 pad 1.27)
  other vias: 43.18,33.02
N$63  (via drill 1.1 pad 1.27)
  other vias: 45.72,33.02
N$64  (via drill 1.1 pad 1.27)
  other vias: 48.26,33.02
N$65  (via drill 1.1 pad 1.27)
  other vias: 50.8,33.02
N$66  (via drill 1.1 pad 1.27)
  other vias: 53.34,33.02
N$67  (via drill 1.1 pad 1.27)
  other vias: 55.88,33.02
N$68  (via drill 1.1 pad 1.27)
  other vias: 58.42,33.02
N$69  (via drill 1.1 pad 1.27)
  other vias: 60.96,33.02
N$70  (via drill 1.1 pad 1.27)
  other vias: 63.5,33.02
N$71  (via drill 1.1 pad 1.27)
  other vias: 38.1,30.48
N$72  (via drill 1.1 pad 1.27)
  other vias: 40.64,30.48
N$73  (via drill 1.1 pad 1.27)
  other vias: 43.18,30.48
N$74  (via drill 1.1 pad 1.27)
  other vias: 45.72,30.48
N$75  (via drill 1.1 pad 1.27)
  other vias: 48.26,30.48
N$76  (via drill 1.1 pad 1.27)
  other vias: 50.8,30.48
N$77  (via drill 1.1 pad 1.27)
  other vias: 53.34,30.48
N$78  (via drill 1.1 pad 1.27)
  other vias: 55.88,30.48
N$79  (via drill 1.1 pad 1.27)
  other vias: 58.42,30.48
N$80  (via drill 1.1 pad 1.27)
  other vias: 60.96,30.48
N$83  (via drill 1.1 pad 1.27)
  other vias: 66.04,33.02
N$85  (via drill 1.1 pad 1.27)
  other vias: 38.1,45.72
N$87  (via drill 1.1 pad 1.27)
  other vias: 60.96,43.18
N$88  (via drill 1.1 pad 1.27)
  other vias: 63.5,43.18
N$89
  cutout Top: 19.56,40.13 16.51,40.13 14.99,41.66 14.99,43.31 16.38,44.7 23.5,44.7 23.88,44.7 25.27,43.31 25.27,41.66 23.88,40.26 23.75,40.13
N$91
  cutout Top: 15.11,53.59 15.11,50.8 16.51,49.4 23.75,49.4 23.75,51.31 29.97,51.18 29.97,45.97 57.15,45.97 64.14,38.99 66.8,38.99 67.44,39.62 67.44,53.59 66.42,54.61 16.13,54.61
  cutout Bottom: 15.11,53.59 15.11,50.8 16.51,49.4 23.75,49.4 25.91,47.24 28.7,47.24 29.97,45.97 57.15,45.97 64.14,38.99 66.8,38.99 67.44,39.62 67.44,53.59 66.42,54.61 16.13,54.61
N$92
  cutout Bottom: 65.41,21.21 66.17,21.21 66.17,21.34 65.66,21.84 65.66,21.46
N$93
  Top 0.406: U1.2 21.21,35.18 21.97,34.42 24,34.42 24.77,35.18 R7.1
  Bottom 0.406: R7.1 24.77,36.58 25.27,37.08 28.32,37.08 D2.K
PWRIN
  Top 1.016: D5.A 17.78,2.79 15.49,5.08 15.11,5.08 11.94,8.26 J1.+
RESET  (via drill 0.35)
  Top 0.406: U3.1 63.25,16.51 60.71,13.97 58.27,13.97 57.39,13.1 39.13,13.1 v39.12,13.08
  Bottom 0.406: S1.1 S1.2 12.5,47.62 16,47.62 17.68,49.3 17.68,52.02 18.14,52.48 61.5,52.48 62.23,51.75 62.23,32 62.48,31.75 64.39,31.75 64.77,31.37 64.77,24.38 63.5,23.11 ICSP.5 | U3.1 63.25,18.54 R10.1 63.5,21.34 ICSP.5 | ICSP.5 62.61,23.5 JP2.1 60.33,23.88 | POWER.3 33.53,2.54 35.05,1.02 36.07,1.02 36.83,1.78 36.83,6.52 39.12,8.8 v39.12,13.08
SCK
  Top 0.406: 26.16,15.75 26.16,25.15 31.37,30.35 31.37,35.56 28.83,38.1 28.83,49.91 28.7,50.04 28.7,50.55 IOH.6 | ICSP.3 64.77,23.88 64.77,21.84 63.63,20.7 63.63,19.68 65.22,18.1 65.22,16.07 61.59,12.45 58.93,12.45 57.91,11.43 40.26,11.43 | U2.5 19.56,17.65 21.46,15.75 26.16,15.75 | 26.16,15.75 26.16,14.1 29.12,11.14 35.91,11.14 36.2,11.43 40.26,11.43 | 40.26,11.43 40.26,9.65 U3.19
SS  (via drill 0.35)
  Top 0.406: IOH.3 36.83,50.55 36.83,36.96 35.56,35.69 35.56,25.27 33.02,22.73 32.51,22.73 31.37,21.59 31.37,20.7 29.97,19.3 29.34,19.3 28.45,18.41 28.45,14.86 29.97,13.34 v32.77,13.34
  Bottom 0.406: 32.64,9.65 U3.16 v32.77,13.34
USBVCC  (via drill 0.3)
  Top 0.406: U1.16 22.48,29.72 21.97,29.21 17.48,29.21 15.85,27.58 | T1.1 15.85,27.58 | 15.85,27.58 JP3.1 | X1.1 8.64,40.64 11.43,40.64
  Top 1.016: 11.43,40.64 v11.56,40.64 v12.45,40.64 v13.34,40.64
  Bottom 1.016: 11.43,40.64 v11.56,40.64 v12.45,40.64 v13.34,40.64 15.75,38.23 JP3.1
V+  (via drill 0.35)
  Top 1.016: U4.3 8.15,18.57 7.37,17.78 7.37,12.83 8.38,11.81 12.08,11.81 15.62,8.27 15.62,6.73 R1.2 | C6.+ 23.37,5.59 37.47,5.59 38.73,4.32 v40.01,4.32 v40.77,4.32 v41.53,4.32 41.4,4.32
  Bottom 1.016: POWER.8 45.72,3.81 45.21,4.32 v41.53,4.32 v40.77,4.32 v40.01,4.32 | R1.2 17.4,4.95 22.73,4.95 C6.+ 23.24,4.83 25.4,2.67 D5.C
XI
  Top 0.406: U1.7 14.86,36.83 20.45,42.42 Q2.2
  Bottom 0.406: Q2.2 25.02,44.83 C13.1
XO
  Top 0.406: U1.8 13.59,36.7 17.78,40.89 Q2.1
  Top 0.5: C14.1 16.89,43.31 Q2.1
XTAL1
  Top 0.406: U3.9 42.93,19.56 C9.2 | C9.2 42.93,21.08 Q1.1 | C9.2
XTAL2
  Top 0.406: U3.10 41.02,17.78 C8.2 40.64,20.19 Q1.2

### Text on the board
Bottom: Mehanik | designed by
bPlace: HACKSPACE NSU | TH/NSU v1.1 | FREEDUINO
tNames: SCL | SDA | REF | GND | 13 | 12 | 11 | 10 | 9 | 8 | 7 | 6 | 5 | 4 | 3 | 2 | 1 | 0 | ~ | ~ | ~ | ~ | ~ | ~ | T | R | + | RX | + | TX | + | ON | + | 5V | RST | 3V3 | 5V | GND | VIN | A0 | A1 | A2 | A3 | A4 | A5
bNames: SCL | SDA | REF | GND | 11 | 10 | 9 | 8 | 7 | 5 | 4 | 3 | 2 | 1 | 0 | 13 | 12 | 6 | ~ | ~ | ~ | ~ | ~ | ~ | T | R | 5V | RST | 3V3 | 5V | GND | GND | VIN | A0 | A1 | A2 | A3 | A4 | A5
bStop: Mehanik | designed by
214bmp: D:/SmartProjects/Snc/a4_bn_logo2.bmp